# EAGLE design ESP8266-ESP12_IoT (EAGLE 7.3.0)
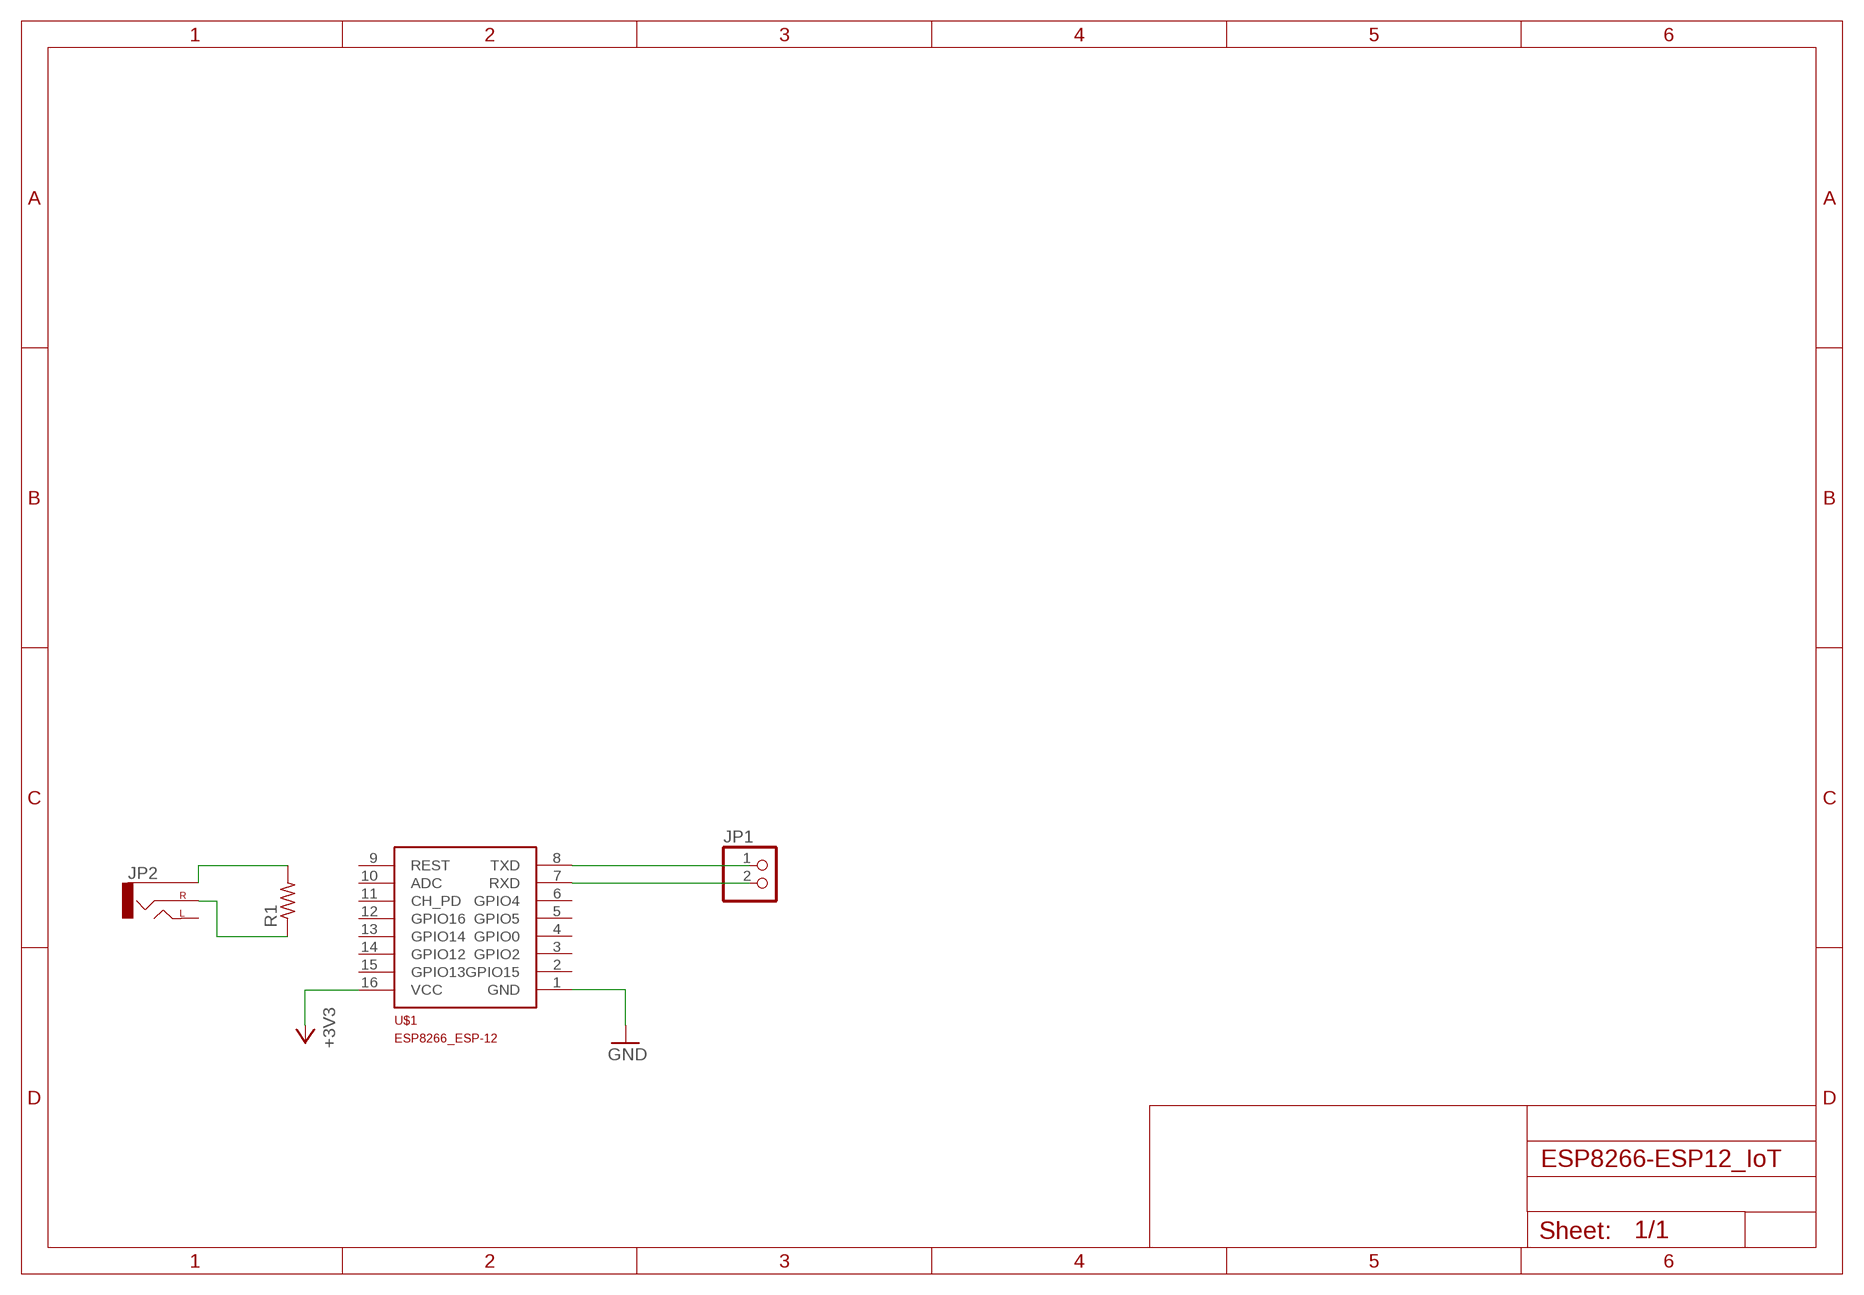
[diagram p0: schematic, sheet 1]

## Parts
JP1  PINHD-1X2/90  [1X02/90]
JP2  AUDIO-JACKPTH  [AUDIO-JACK]
R1  R-US_R0805  [R0805]
U$1  ESP8266_ESP-12  [ESP8266-ESP12]

## Nets
+3V3: U$1.16(VCC)
GND: U$1.1(GND)
N$1: JP1.1 U$1.8(TXD)
N$2: JP1.2 U$1.7(RXD)
N$3: JP2.SLEEVE R1.2
N$4: JP2.RING(RIGHT) R1.1
Unconnected: JP2.TIP(LEFT) U$1.2(GPIO15) U$1.3(GPIO2) U$1.4(GPIO0) U$1.5(GPIO5) U$1.6(GPIO4) U$1.9(REST) U$1.10(ADC) U$1.11(CH_PD) U$1.12(GPIO16) U$1.13(GPIO14) U$1.14(GPIO12) U$1.15(GPIO13)

## Library data of the parts
JP1 = pinhead:PINHD-1X2: PIN HEADER
JP2 = SparkFun-Connectors:AUDIO-JACK: 3.5mm Audio Jack Simple 3.5mm common PCB mount audio jack. Variant PTH is our storefront SKU PRT-08032
R1 = resistor:R-US_: RESISTOR, American symbol
U$1 = ESP8266-ESP12:ESP8266_ESP-12

## Board
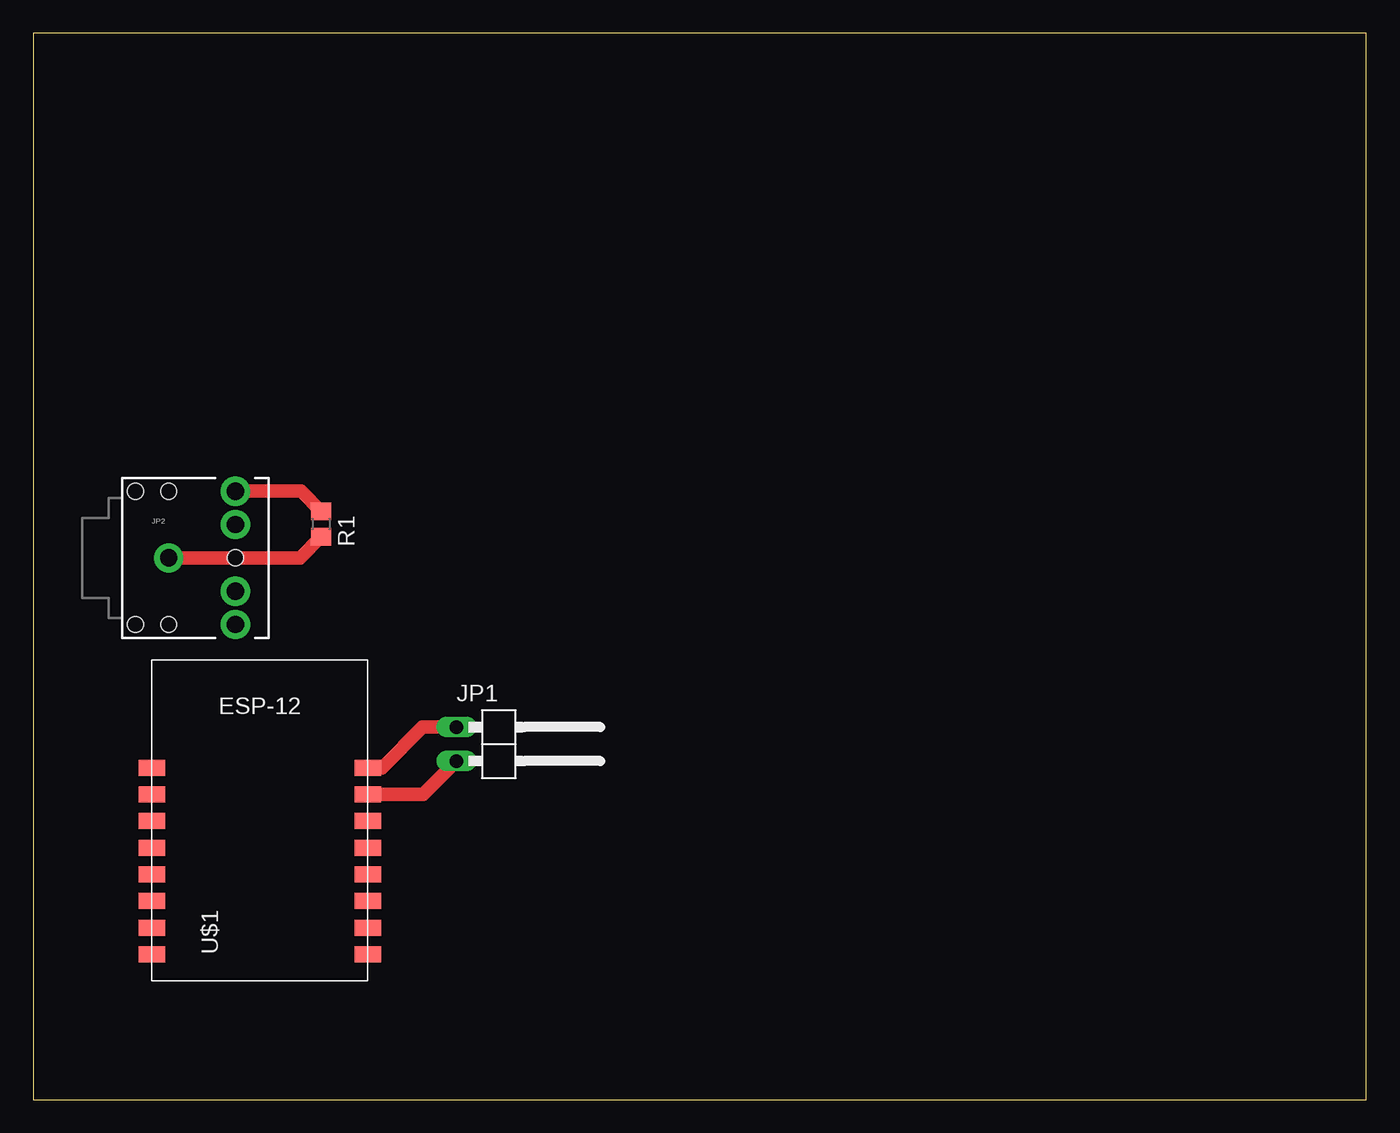
[diagram p1: board, top side]

Size 100 x 80 mm. Coordinates in mm from the lower left corner, seen from the top.
Outline: 0,0 100,0 100,80 0,80 0,0
Copper layers (1*16): Top 0.035mm / dielectric 1.5mm / Bottom 0.035mm
Design rules "default": minimum track width 10mil, minimum drill 24mil, track to track 8mil, track to pad 8mil, pad to pad 8mil, via to via 8mil, smd to smd 8mil, copper to edge 40mil, drill to drill 8mil, minimum pad ring 10mil, minimum via ring 8mil, stop-mask expansion 4mil, vias tented up to drill 0mil, thermal gap 10mil

### Footprints (pad centres in the part's own frame; a part is rotated, then mirrored left to right if it is on the bottom)
1X02/90 = drill 1.016 long: 1 -1.27,-3.81; 2 1.27,-3.81
AUDIO-JACK = drill 1.3 pad 2.184: RING 5,5; RSH 5,2.5; SLEEVE 0,0; TIP 5,-5; TSH 5,-2.5 | hole 1.2: 0,5; -2.5,5; -2.5,-5; 0,-5; 5,0
R0805 = smd 1.3 x 1.5: 1 -0.95,0; 2 0.95,0
ESP8266-ESP12 = smd 2 x 1.2: 1 16.2,2; 2 16.2,4; 3 16.2,6; 4 16.2,8; 5 16.2,10; 6 16.2,12; 7 16.2,14; 8 16.2,16; 9 0,16; 10 0,14; 11 0,12; 12 0,10; 13 0,8; 14 0,6; 15 0,4; 16 0,2

### Placement (x,y rotation side)
JP1  35.56,26.67 270 top
JP2  10.16,40.64 0 top
R1  21.59,43.18 270 top
U$1  8.89,8.89 0 top

### Tracks (layer width: path | path; a pad name or v marks a point on that pad's centre or on a via)
N$1
  Top 1.016: U$1.8 26.16,24.89 29.21,27.94 JP1.1
N$2
  Top 1.016: U$1.7 29.24,22.89 JP1.2
N$3
  Top 1.016: JP2.SLEEVE 20,40.64 R1.2
N$4
  Top 1.016: JP2.RING 20.08,45.64 R1.1